# EAGLE design W533X (EAGLE 6.6.0)
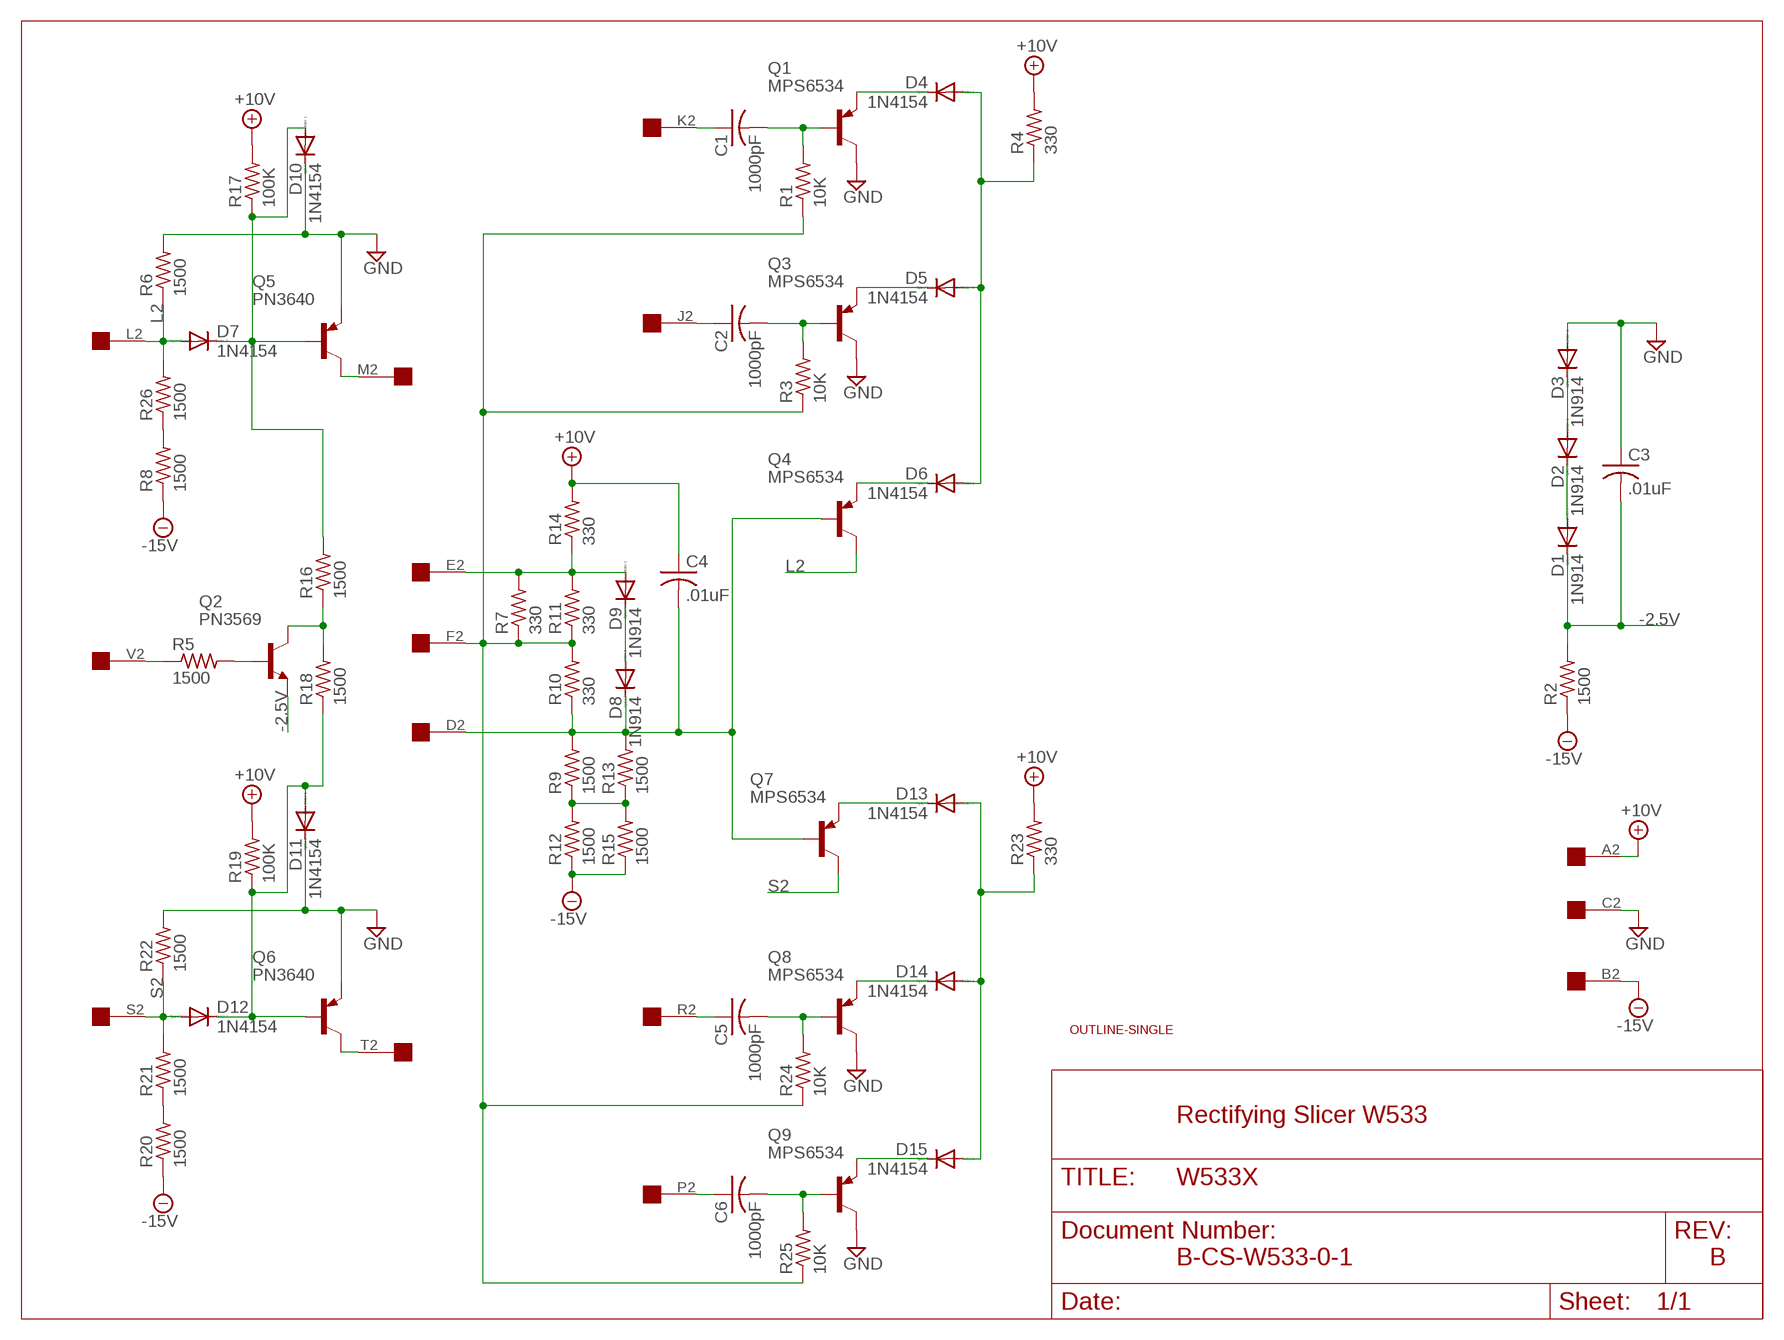
[diagram p0: schematic, sheet 1]

## Parts
C1  1000pF  C-US075-032X103  [C075-032X103]
C2  1000pF  C-US075-032X103  [C075-032X103]
C3  .01uF  C-US050-025X075  [C050-025X075]
C4  .01uF  C-US050-025X075  [C050-025X075]
C5  1000pF  C-US075-032X103  [C075-032X103]
C6  1000pF  C-US075-032X103  [C075-032X103]
D1  1N914  1N4148DO35-10  [DO35-10]
D2  1N914  1N4148DO35-10  [DO35-10]
D3  1N914  1N4148DO35-10  [DO35-10]
D4  1N4154  1N4148DO35-10  [DO35-10]
D5  1N4154  1N4148DO35-10  [DO35-10]
D6  1N4154  1N4148DO35-10  [DO35-10]
D7  1N4154  1N4148DO35-10  [DO35-10]
D8  1N914  1N4148DO35-10  [DO35-10]
D9  1N914  1N4148DO35-10  [DO35-10]
D10  1N4154  1N4148DO35-10  [DO35-10]
D11  1N4154  1N4148DO35-10  [DO35-10]
D12  1N4154  1N4148DO35-10  [DO35-10]
D13  1N4154  1N4148DO35-10  [DO35-10]
D14  1N4154  1N4148DO35-10  [DO35-10]
D15  1N4154  1N4148DO35-10  [DO35-10]
Q1  MPS6534  2N2904  [TO39]
Q2  PN3569  2N2102  [TO5]
Q3  MPS6534  2N2904  [TO39]
Q4  MPS6534  2N2904  [TO39]
Q5  PN3640  2N2904  [TO39]
Q6  PN3640  2N2904  [TO39]
Q7  MPS6534  2N2904  [TO39]
Q8  MPS6534  2N2904  [TO39]
Q9  MPS6534  2N2904  [TO39]
R1  10K  R-US_0207/10  [0207/10]
R2  1500  R-US_0207/10  [0207/10]
R3  10K  R-US_0207/10  [0207/10]
R4  330  R-US_0207/10  [0207/10]
R5  1500  R-US_0207/10  [0207/10]
R6  1500  R-US_0207/10  [0207/10]
R7  330  R-US_0207/10  [0207/10]
R8  1500  R-US_0207/10  [0207/10]
R9  1500  R-US_0207/10  [0207/10]
R10  330  R-US_0207/10  [0207/10]
R11  330  R-US_0207/10  [0207/10]
R12  1500  R-US_0207/10  [0207/10]
R13  1500  R-US_0207/10  [0207/10]
R14  330  R-US_0207/10  [0207/10]
R15  1500  R-US_0207/10  [0207/10]
R16  1500  R-US_0207/10  [0207/10]
R17  100K  R-US_0207/10  [0207/10]
R18  1500  R-US_0207/10  [0207/10]
R19  100K  R-US_0207/10  [0207/10]
R20  1500  R-US_0207/10  [0207/10]
R21  1500  R-US_0207/10  [0207/10]
R22  1500  R-US_0207/10  [0207/10]
R23  330  R-US_0207/10  [0207/10]
R24  10K  R-US_0207/10  [0207/10]
R25  10K  R-US_0207/10  [0207/10]
R26  1500  R-US_0207/10  [0207/10]
U$1  OUTLINE-SINGLE  [SINGLE]
U$2  EDGE-1  [EDGE-CON1]

## Nets
+10V: C4.1 R4.2 R14.2 R17.2 R19.2 R23.2 U$2.A2
-2.5V: C3.2 D1.C Q2.1(E) R2.2
-15V: R2.1 R8.1 R12.1 R15.1 R20.1 U$2.B2
GND [Supply]: C3.1 D3.A D10.C D11.C Q1.3(C) Q3.3(C) Q5.1(E) Q6.1(E) Q8.3(C) Q9.3(C) R6.2 R22.2 U$2.C2
L2: D7.A Q4.3(C) R6.1 R26.2 U$2.L2
N$1: C1.1 U$2.K2
N$2: R5.1 U$2.V2
N$3: C1.2 Q1.2(B) R1.2
N$4: D4.C Q1.1(E)
N$5: D5.C Q3.1(E)
N$6: C2.1 U$2.J2
N$7: D14.C Q8.1(E)
N$8: C2.2 Q3.2(B) R3.2
N$9: D15.C Q9.1(E)
N$10: Q2.2(B) R5.2
N$11: C5.1 U$2.R2
N$12: Q6.3(C) U$2.T2
N$13: C5.2 Q8.2(B) R24.2
N$14: Q5.3(C) U$2.M2
N$15: R8.2 R26.1
N$16: C6.1 U$2.P2
N$17: D13.C Q7.1(E)
N$18: C6.2 Q9.2(B) R25.2
N$19: R20.2 R21.1
N$20: D6.C Q4.1(E)
N$21: D7.C D10.A Q5.2(B) R16.2 R17.1
N$22: Q2.3(C) R16.1 R18.2
N$23: C4.2 D8.C Q4.2(B) Q7.2(B) R9.2 R10.1 R13.2 U$2.D2
N$24: D11.A D12.C Q6.2(B) R18.1 R19.1
N$25: R9.1 R12.2 R13.1 R15.2
N$26: R1.1 R3.1 R7.1 R10.2 R11.1 R24.1 R25.1 U$2.F2
N$27: D2.A D3.C
N$28: D4.A D5.A D6.A R4.1
N$29: D1.A D2.C
N$30: D8.A D9.C
N$31: D9.A R7.2 R11.2 R14.1 U$2.E2
N$32: D13.A D14.A D15.A R23.1
S2: D12.A Q7.3(C) R21.2 R22.1 U$2.S2
Unconnected: U$2.H2 U$2.N2 U$2.U2

## Notes on the sheet
- Rectifying Slicer W533
- B-CS-W533-0-1 | B

## Library data of the parts
C1-C6 = rcl:C-US: CAPACITOR, American symbol
D1-D15 = diode:1N4148: DIODE high speed (Philips)
Q1 Q3-Q9 = transistor-pnp:2N2904*: PNP Transistror
Q2 = transistor:2N2102: NPN TRANSISTOR
R1-R26 = rcl:R-US_: RESISTOR, American symbol
U$1 = dec-con:OUTLINE-*: Board outlines for DEC boards.
U$2 = dec-con:EDGE-1: Single-Sided DEC Edge Connector -- (side 2)

## Net classes
1 Supply: width 0.813 mm

## Board
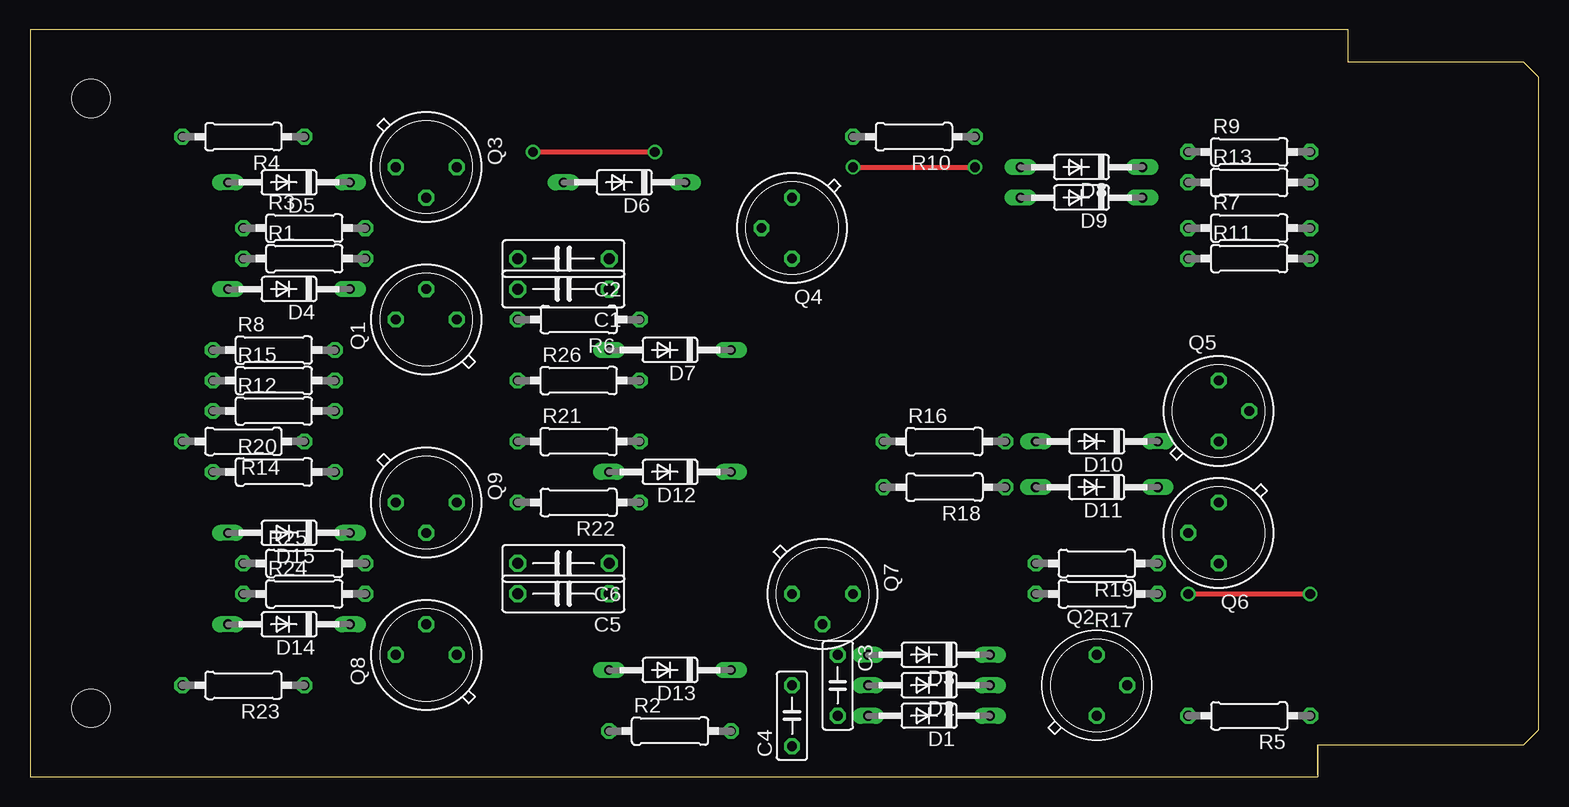
[diagram p1: board, top side]
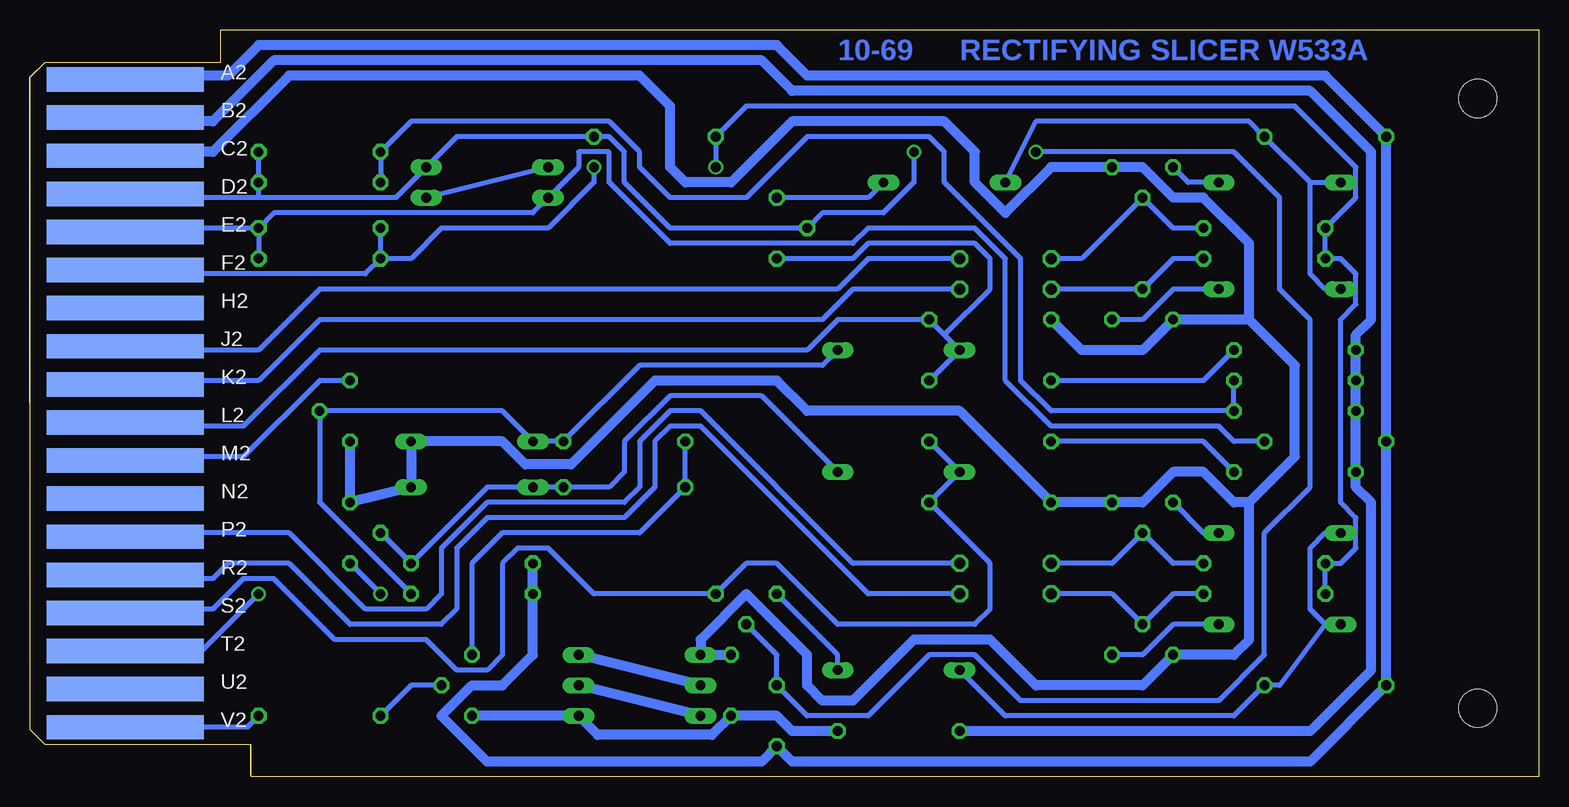
[diagram p2: board, bottom side, seen from below]

Size 125.73 x 62.23 mm. Coordinates in mm from the lower left corner, seen from the top.
Copper layers (1+16): Top 0.035mm / dielectric 1.5mm / Bottom 0.035mm
Design rules "16mils": minimum track width 16mil, minimum drill 32mil, track to track 15mil, track to pad 10mil, pad to pad 10mil, via to via 10mil, smd to smd 10mil, copper to edge 13mil, drill to drill 10mil, minimum pad ring 10mil, minimum via ring 8mil, stop-mask expansion 0mil, vias tented up to drill 0mil, thermal gap 10mil

### Footprints (pad centres in the part's own frame; a part is rotated, then mirrored left to right if it is on the bottom)
C075-032X103 = drill 0.914 octagon: 1 -3.81,0; 2 3.81,0
C050-025X075 = drill 0.813 octagon: 1 -2.54,0; 2 2.54,0
DO35-10 = drill 0.813 long: A 5.08,0; C -5.08,0
TO39 = drill 0.813 octagon: 1 0,-2.54; 2 2.54,0; 3 0,2.54
TO5 = drill 0.813 octagon: 1 0,-2.54; 2 2.54,0; 3 0,2.54
0207/10 = drill 0.813 octagon: 1 -5.08,0; 2 5.08,0
SINGLE = hole 3.175: 120.65,56.515; 120.65,5.715
EDGE-CON1 = smd 13.106 x 2.032 bottom: A2 7.938,4.128; B2 7.938,7.303; C2 7.938,10.477; D2 7.938,13.652; E2 7.938,16.828; F2 7.938,20.003; H2 7.938,23.177; J2 7.938,26.352; K2 7.938,29.527; L2 7.938,32.703; M2 7.938,35.877; N2 7.938,39.053; P2 7.938,42.227; R2 7.938,45.403; S2 7.938,48.578; T2 7.938,51.752; U2 7.938,54.928; V2 7.938,58.102

### Placement (x,y rotation side)
C1  44.45,40.64 180 top
C2  44.45,43.18 180 top
C3  67.31,7.62 270 top
C4  63.5,5.08 90 top
C5  44.45,15.24 180 top
C6  44.45,17.78 180 top
D1  74.93,5.08 180 top
D2  74.93,7.62 180 top
D3  74.93,10.16 180 top
D4  21.59,40.64 180 top
D5  21.59,49.53 180 top
D6  49.53,49.53 180 top
D7  53.34,35.56 180 top
D8  87.63,50.8 180 top
D9  87.63,48.26 180 top
D10  88.9,27.94 180 top
D11  88.9,24.13 180 top
D12  53.34,25.4 180 top
D13  53.34,8.89 180 top
D14  21.59,12.7 180 top
D15  21.59,20.32 180 top
Q1  33.02,38.1 90 top
Q2  88.9,7.62 0 top
Q3  33.02,50.8 270 top
Q4  63.5,45.72 180 top
Q5  99.06,30.48 0 top
Q6  99.06,20.32 180 top
Q7  66.04,15.24 270 top
Q8  33.02,10.16 90 top
Q9  33.02,22.86 270 top
R1  22.86,43.18 0 top
R2  53.34,3.81 0 top
R3  22.86,45.72 0 top
R4  17.78,53.34 180 top
R5  101.6,5.08 180 top
R6  45.72,38.1 180 top
R7  101.6,45.72 0 top
R8  20.32,35.56 0 top
R9  101.6,52.07 0 top
R10  73.66,53.34 180 top
R11  101.6,43.18 0 top
R12  20.32,30.48 0 top
R13  101.6,49.53 0 top
R14  17.78,27.94 180 top
R15  20.32,33.02 0 top
R16  76.2,27.94 0 top
R17  88.9,15.24 180 top
R18  76.2,24.13 180 top
R19  88.9,17.78 180 top
R20  20.32,25.4 0 top
R21  45.72,27.94 0 top
R22  45.72,22.86 180 top
R23  17.78,7.62 180 top
R24  22.86,15.24 0 top
R25  22.86,17.78 0 top
R26  45.72,33.02 0 top
U$1  125.73,62.23 180 top
U$2  125.73,62.23 180 top

### Tracks (layer width: path | path; a pad name or v marks a point on that pad's centre or on a via)
+10V
  Bottom 0.813: U$2.A2 117.22,58.04 116.84,58.42 109.22,58.42 106.68,60.96 63.5,60.96 60.96,58.42 17.78,58.42 R4.2 R14.2 R23.2 19.05,1.27 62.23,1.27 C4.1 64.77,1.27 87.63,1.27 91.44,5.08 88.9,7.62 86.36,7.62 83.82,10.16 R17.2 R19.2
-2.5V
  Bottom 0.813: R2.2 62.23,3.81 63.5,5.08 C3.2 68.9,3.49 78.42,3.49 D1.C Q2.1
-15V
  Bottom 0.813: U$2.B2 117.13,54.9 116.84,54.61 110.49,54.61 105.41,59.69 64.77,59.69 62.23,57.15 19.05,57.15 13.97,52.07 13.97,38.1 15.24,36.83 R8.1 R15.1 R12.1 R20.1 15.24,24.13 13.97,22.86 13.97,8.89 19.05,3.81 R2.1
GND
  Bottom 0.813: U$2.C2 117.17,51.74 116.84,52.07 110.49,52.07 104.14,58.42 74.93,58.42 72.39,55.88 72.39,50.8 71.12,49.53 67.31,49.53 62.23,54.61 49.53,54.61 46.99,52.07 46.99,49.53 44.45,46.99 40.64,50.8 Q3.3 33.02,50.8 30.48,48.26 27.94,48.26 24.13,44.45 24.13,38.1 | C3.1 D3.A 69.85,11.43 66.04,15.24 60.96,10.16 60.96,7.62 59.69,6.35 57.15,6.35 52.07,11.43 45.72,11.43 41.91,7.62 33.02,7.62 Q8.3 25.4,10.16 24.13,11.43 24.13,22.86 | Q5.1 Q6.1 D11.C D10.C 86.36,27.94 84.45,26.04 80.64,26.04 73.66,33.02 63.5,33.02 60.96,30.48 48.26,30.48 R22.2 Q9.3 33.02,22.86 30.48,25.4 27.94,25.4 25.4,22.86 24.13,22.86 | 24.13,38.1 Q1.3 33.02,35.56 38.1,35.56 R6.2 | 24.13,38.1 20.32,34.29 20.32,26.67 24.13,22.86
L2
  Bottom 0.406: U$2.L2 117.17,29.54 116.84,29.21 107.95,29.21 101.6,35.56 60.96,35.56 58.42,38.1 R6.1 49.53,36.83 | 49.53,36.83 D7.A R26.2 | Q4.3 57.15,43.18 55.88,44.45 46.99,44.45 45.72,43.18 45.72,40.64 49.53,36.83
N$1
  Bottom 0.406: U$2.K2 117.14,32.72 116.84,33.02 106.68,33.02 101.6,38.1 59.69,38.1 57.15,40.64 C1.1
N$2
  Bottom 0.406: U$2.V2 107.63,4.13 R5.1
N$3
  Bottom 0.406: R1.2 30.48,43.18 Q1.2 C1.2
N$4
  Bottom 0.406: D4.C 30.48,40.64 33.02,38.1 Q1.1
N$5
  Bottom 0.406: D5.C 29.21,49.53 Q3.1
N$6
  Bottom 0.406: U$2.J2 117.17,35.89 116.84,35.56 106.68,35.56 101.6,40.64 58.42,40.64 55.88,43.18 C2.1
N$7
  Bottom 0.406: D14.C 30.48,12.7 33.02,10.16 Q8.1
N$8
  Bottom 0.406: R3.2 30.48,45.72 Q3.2 38.1,43.18 C2.2
N$9
  Bottom 0.406: D15.C 27.94,20.32 Q9.1
N$10
  Bottom 0.406: Q2.2 93.98,7.62 R5.2
N$11
  Bottom 0.406: U$2.R2 117.17,16.84 116.84,16.51 110.49,16.51 109.22,17.78 104.14,17.78 99.06,12.7 91.44,12.7 90.17,13.97 90.17,19.05 87.63,21.59 76.2,21.59 73.66,24.13 73.66,27.94 72.39,29.21 69.85,29.21 55.88,15.24 C5.1
N$12  (via drill 0.81)
  Top 0.406: v96.52,15.24 v106.68,15.24
  Bottom 0.406: U$2.T2 116.84,10.49 116.84,10.16 111.76,10.16 v106.68,15.24 | v96.52,15.24 Q6.3
N$13
  Bottom 0.406: C5.2 35.56,15.24 Q8.2 30.48,15.24 R24.2
N$14
  Bottom 0.406: U$2.M2 117.17,26.34 116.84,26.67 107.95,26.67 101.6,33.02 Q5.3
N$15
  Bottom 0.406: R26.1 27.94,33.02 R8.2
N$16
  Bottom 0.406: U$2.P2 117.17,19.99 116.84,20.32 104.14,20.32 97.79,13.97 92.71,13.97 91.44,15.24 91.44,19.05 87.63,22.86 76.2,22.86 74.93,24.13 74.93,27.94 72.39,30.48 69.85,30.48 57.15,17.78 C6.1
N$17
  Bottom 0.406: Q7.1 58.42,10.16 D13.C
N$18
  Bottom 0.406: R25.2 30.48,17.78 Q9.2 35.56,17.78 C6.2
N$19
  Bottom 0.406: R21.1 27.94,27.94 R20.2
N$20
  Bottom 0.406: D6.C 55.88,48.26 Q4.1
N$21
  Bottom 0.406: R17.1 101.6,22.86 Q5.2 86.36,30.48 D10.A R16.2 74.93,34.29 59.69,34.29 D7.C
N$22
  Bottom 0.406: R16.1 R18.2 74.93,20.32 86.36,20.32 88.9,17.78 Q2.3
N$23  (via drill 0.81)
  Top 0.406: v41.91,52.07 v52.07,52.07
  Bottom 0.406: U$2.D2 117.14,48.56 116.84,48.26 106.68,48.26 | 106.68,48.26 R13.2 R9.2 | 106.68,48.26 95.25,48.26 D8.C 90.17,53.34 R10.1 77.47,53.34 76.2,52.07 76.2,49.53 72.39,45.72 Q4.2 59.69,46.99 54.61,46.99 52.07,49.53 v52.07,52.07 | Q7.2 63.5,10.16 C4.2 60.96,5.08 55.88,5.08 50.8,10.16 46.99,10.16 43.18,6.35 26.67,6.35 22.86,10.16 22.86,20.32 19.05,24.13 19.05,38.1 21.59,40.64 21.59,48.26 25.4,52.07 v41.91,52.07
N$24
  Bottom 0.406: Q6.2 R19.1 87.63,24.13 D11.A R18.1 77.47,24.13 76.2,25.4 76.2,27.94 72.39,31.75 64.77,31.75 D12.C
N$25
  Bottom 0.406: R13.1 R9.1 93.98,54.61 77.47,54.61 74.93,52.07 74.93,50.8 72.39,48.26 66.04,48.26 60.96,53.34 50.8,53.34 49.53,52.07 49.53,49.53 43.18,43.18 43.18,33.02 40.64,30.48 R12.2 R15.2
N$26  (via drill 0.81)
  Top 0.406: v68.58,50.8 v78.74,50.8
  Bottom 0.406: R11.1 R7.1 | U$2.F2 117.12,42.19 116.84,41.91 97.79,41.91 R11.1 | R11.1 93.98,43.18 91.44,45.72 82.55,45.72 78.74,49.53 v78.74,50.8 | R24.1 R25.1 16.51,17.78 15.24,19.05 15.24,21.59 16.51,22.86 16.51,38.1 15.24,39.37 15.24,41.91 16.51,43.18 R1.1 R3.1 15.24,48.26 15.24,50.8 20.32,55.88 66.04,55.88 R10.2 v68.58,50.8
N$27
  Bottom 0.813: D2.A D3.C
N$28
  Bottom 0.406: 19.05,49.53 R4.1 24.13,54.61 41.91,54.61 D6.A | 19.05,49.53 D5.A | 19.05,49.53 19.05,41.91 17.78,40.64 D4.A
N$29
  Bottom 0.813: D1.A D2.C
N$30
  Bottom 0.406: D8.A D9.C
N$31
  Bottom 0.406: R7.2 R11.2 | U$2.E2 117.17,45.39 116.84,45.72 R7.2 | R7.2 105.41,46.99 83.82,46.99 D9.A 80.01,50.8 80.01,52.07 77.47,52.07 77.47,49.53 72.39,44.45 57.15,44.45 55.88,45.72 46.99,45.72 44.45,43.18 44.45,33.02 40.64,29.21 26.67,29.21 25.4,27.94 R14.1
N$32
  Bottom 0.406: D15.A 17.78,20.32 19.05,19.05 19.05,13.97 17.78,12.7 | 17.78,12.7 21.59,7.62 R23.1 25.4,5.08 44.45,5.08 D13.A | D14.A 17.78,12.7
S2
  Bottom 0.406: U$2.S2 117.14,13.66 116.84,13.97 110.49,13.97 107.95,16.51 105.41,16.51 100.33,11.43 92.71,11.43 90.17,8.89 87.63,8.89 86.36,10.16 86.36,17.78 85.09,19.05 82.55,19.05 78.74,15.24 Q7.3 66.04,17.78 63.5,17.78 58.42,12.7 46.99,12.7 45.72,13.97 45.72,17.78 R22.1 D12.A R21.2

### Text on the board
Bottom: RECTIFYING SLICER W533A | 10-69